# EAGLE design WindStation (EAGLE 9.3.2)
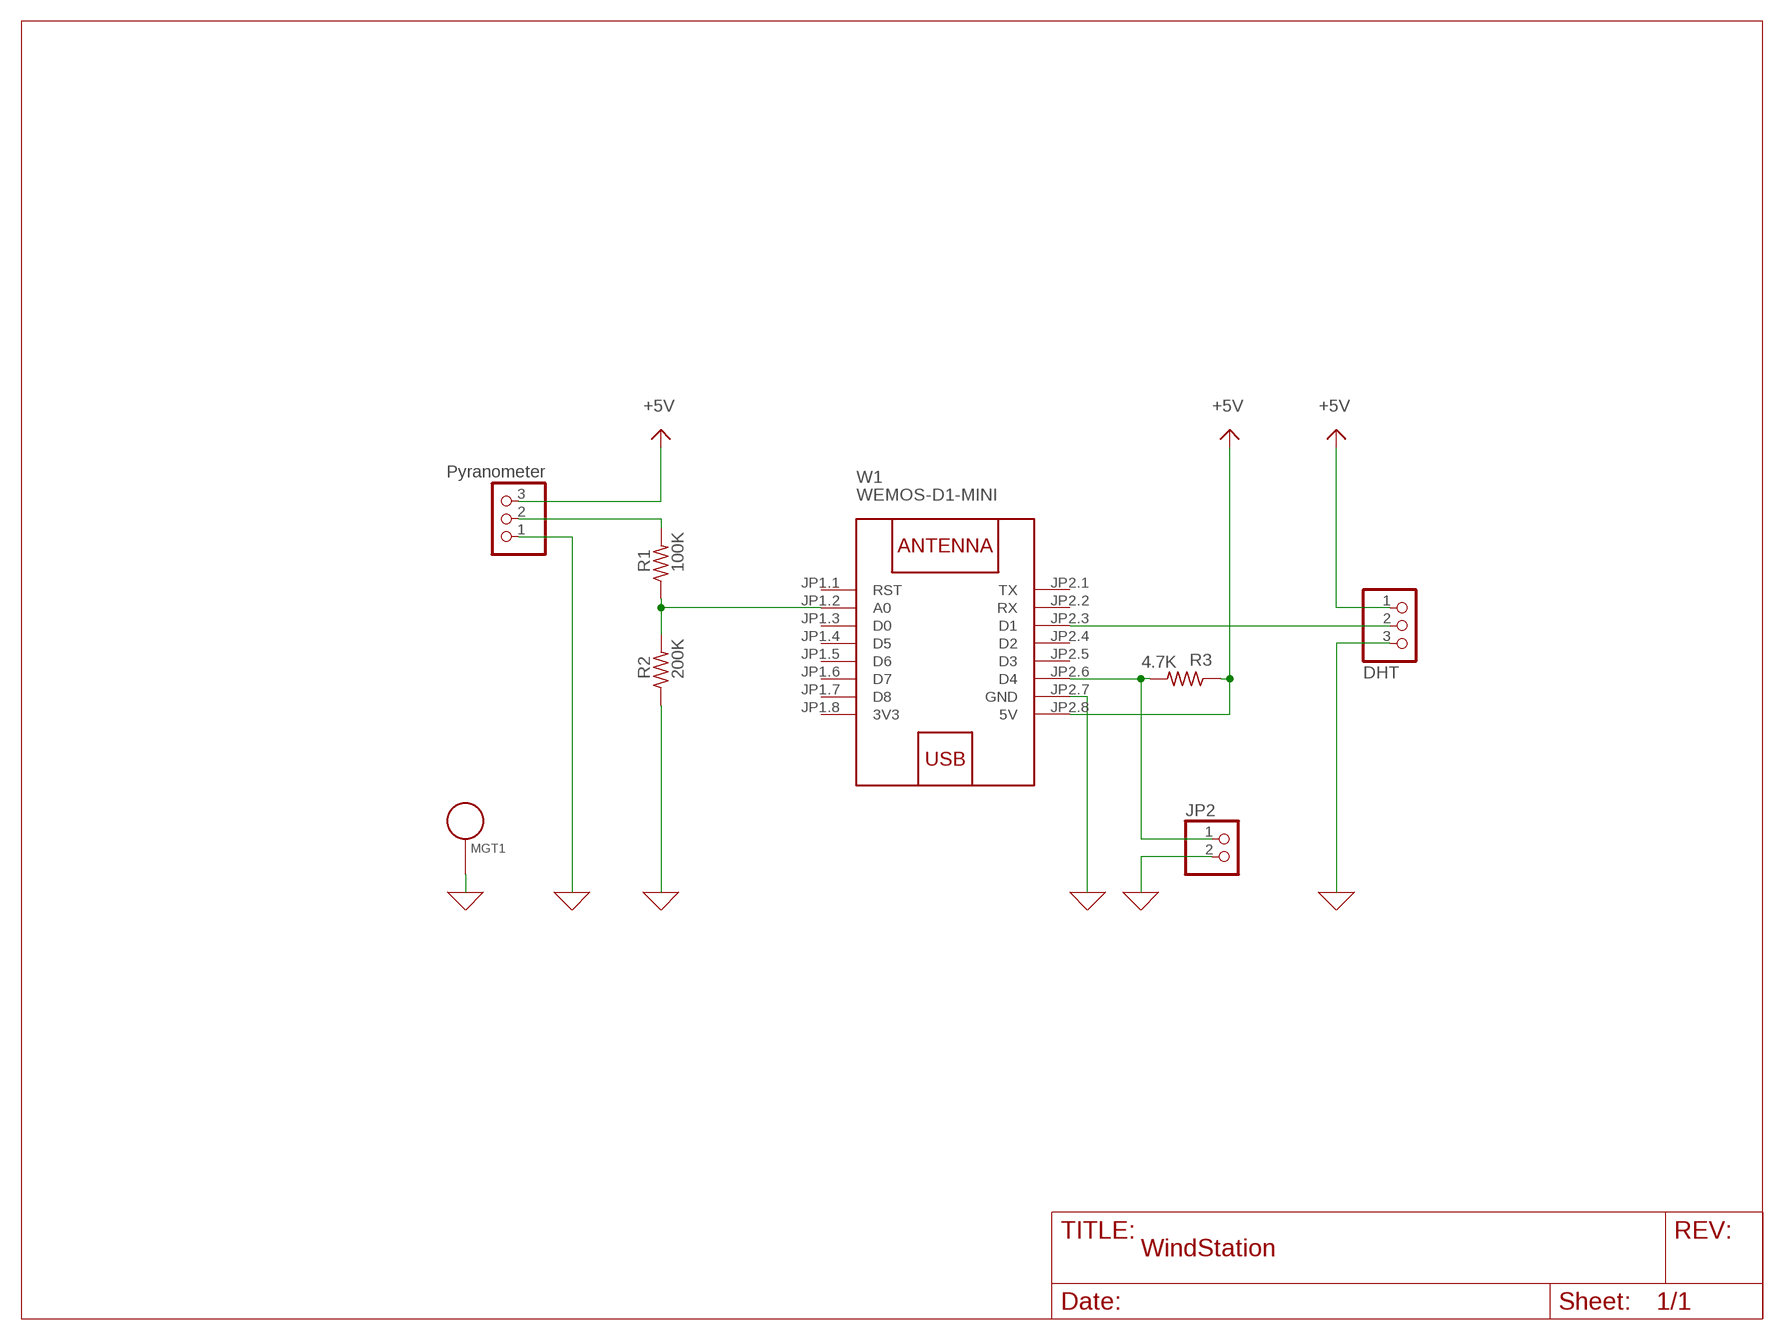
[diagram p0: schematic, sheet 1]

## Parts
JP1  Pyranometer  PINHD-1X3  [1X03]
JP2  PINHD-1X2  [1X02]
JP3  DHT  PINHD-1X3  [1X03]
MGT1  BEAGLEBONEBLACK_MOUNTING_HOLE  [BEAGLEBONEBLACK_MOUNTING_HOLE]
R1  100K  R-US_0207/10  [0207/10]
R2  200K  R-US_0207/10  [0207/10]
R3  4.7K  R-US_0207/10  [0207/10]
W1  WEMOS-D1-MINI  [WEMOS-D1-MINI]

## Nets
0: JP1.1 JP2.2 JP3.3 MGT1.P$1 R2.1 W1.JP2.7(GND) ; supply symbol labelled GND
N$1: JP1.2 R1.2
N$2: R1.1 R2.2 W1.JP1.2(A0)
N$3: JP2.1 R3.2 W1.JP2.6(D4)
N$4: JP3.2 W1.JP2.3(D1)
VCC: JP1.3 JP3.1 R3.1 W1.JP2.8(5V)
Unconnected: W1.JP1.1(RST) W1.JP1.3(D0) W1.JP1.4(D5) W1.JP1.5(D6) W1.JP1.6(D7) W1.JP1.7(D8) W1.JP2.1(TX) W1.JP2.2(RX) W1.JP2.4(D2) W1.JP2.5(D3)

## Notes on the sheet
- +5V | +5V | +5V

## Power pins joined to a net without a drawn wire
3V3: W1.JP1.8(3V3)

## Library data of the parts
JP1 JP3 = adafruit:PINHD-1X3: PIN HEADER
JP2 = pinhead:PINHD-1X2: PIN HEADER
MGT1 = BeagleBone_Black_Wireless:BEAGLEBONEBLACK_MOUNTING_HOLE: Chassis Mounting Hole w/GND connection ability
R1-R3 = adafruit:R-US_: RESISTOR, American symbol
W1 = diy-modules:WEMOS-D1-MINI: WEMOS D1 mini: Mini Wi-Fi Board based on ESP-8266 device More details can be found here: https://www.wemos.cc/product/d1-mini.html Click here to find device on ebay.com <http://www.ebay.com/sch/wemos+d1+mini+nodemcu>

## Board
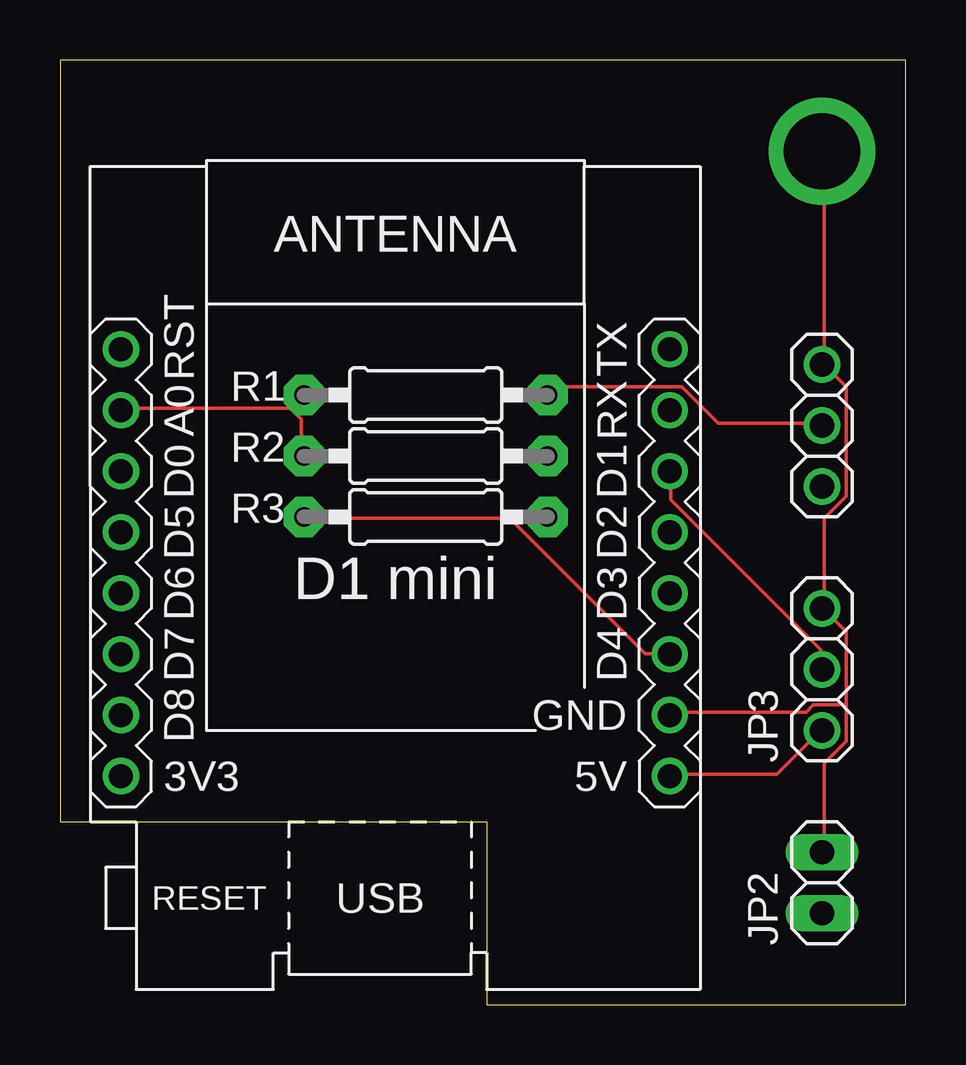
[diagram p1: board, top side]
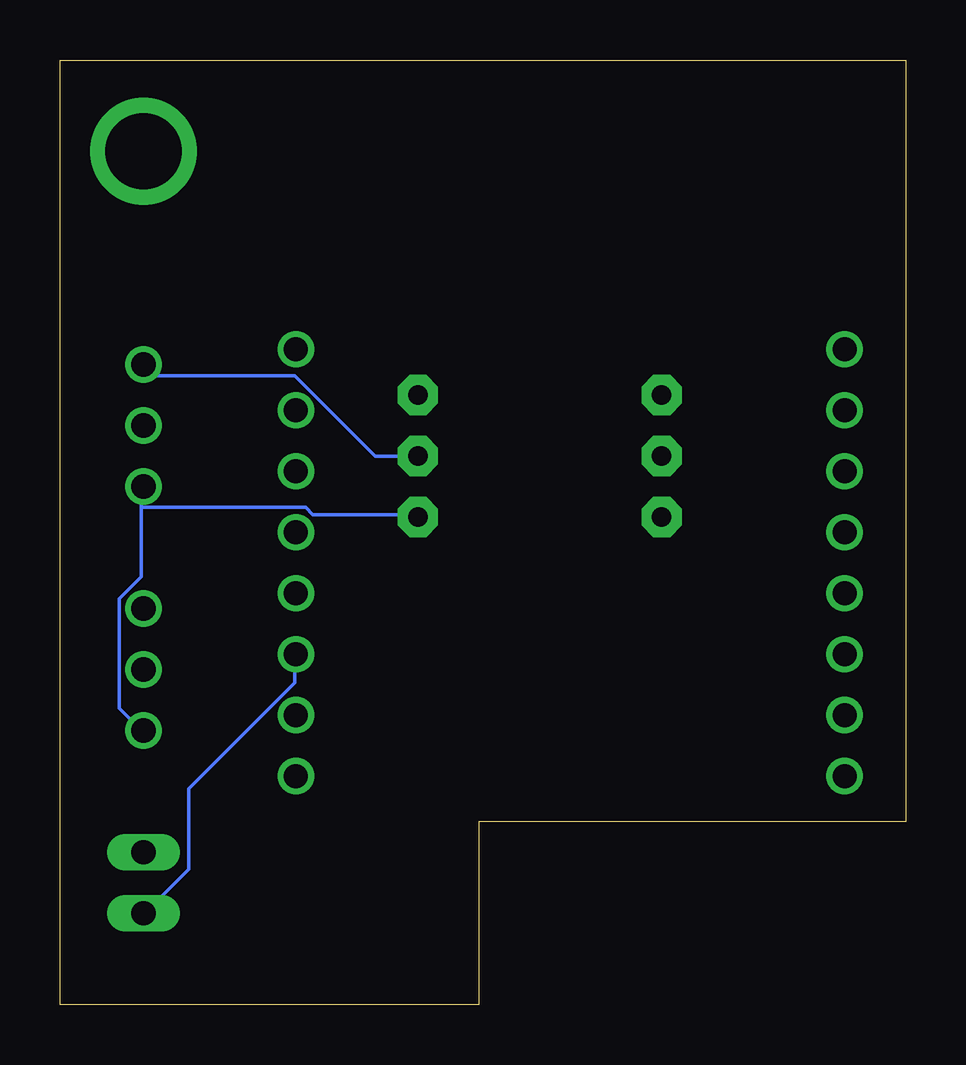
[diagram p2: board, bottom side, seen from below]

Size 35.23 x 39.36 mm. Coordinates in mm from the lower left corner, seen from the top.
Outline: 0,7.62 17.78,7.62 17.78,0 35.23,0 35.23,39.36 0,39.36 0,7.62
Copper layers (1*16): Top 0.035mm / dielectric 1.5mm / Bottom 0.035mm
Design rules "default": minimum track width 6mil, minimum drill 0.35mm, track to track 6mil, track to pad 6mil, pad to pad 6mil, via to via 6mil, smd to smd 6mil, copper to edge 40mil, drill to drill 6mil, minimum pad ring 10mil, minimum via ring 8mil, stop-mask expansion 4mil, vias tented up to drill 0mil, thermal gap 10mil

### Footprints (pad centres in the part's own frame; a part is rotated, then mirrored left to right if it is on the bottom)
1X03 = drill 1.016: 1 -2.54,0; 2 0,0; 3 2.54,0
1X02 = drill 1.016 long: 1 -1.27,0; 2 1.27,0
BEAGLEBONEBLACK_MOUNTING_HOLE = drill 3.175 pad 4.445: P$1 0,0
0207/10 = drill 0.813 pad 1.676 octagon: 1 -5.08,0; 2 5.08,0
WEMOS-D1-MINI = drill 1: JP1.1 -11.43,9.525; JP1.2 -11.43,6.985; JP1.3 -11.43,4.445; JP1.4 -11.43,1.905; JP1.5 -11.43,-0.635; JP1.6 -11.43,-3.175; JP1.7 -11.43,-5.715; JP1.8 -11.43,-8.255; JP2.1 11.43,9.525; JP2.2 11.43,6.985; JP2.3 11.43,4.445; JP2.4 11.43,1.905; JP2.5 11.43,-0.635; JP2.6 11.43,-3.175; JP2.7 11.43,-5.715; JP2.8 11.43,-8.255

### Placement (x,y rotation side)
JP1  31.75,24.13 270 top
JP2  31.75,5.08 90 top
JP3  31.75,13.97 90 top
MGT1  31.75,35.56 0 top
R1  15.24,25.4 0 top
R2  15.24,22.86 180 top
R3  15.24,20.32 180 top
W1  13.97,17.78 0 top

### Tracks (layer width: path | path; a pad name or v marks a point on that pad's centre or on a via)
0
  Top 0.152: 32.77,12.5 32.77,15.54 31.85,16.46 JP3.3 31.85,16.61 31.85,20.27 32.77,21.18 32.77,25.76 31.85,26.67 | 32.77,12.5 32.77,10.97 31.85,10.06 31.85,6.4 JP2.2 | 31.85,26.67 31.85,35.51 MGT1.P$1 | 31.85,26.67 JP1.1 | 32.77,12.5 31.39,12.5 31.09,12.19 25.45,12.19 W1.JP2.7
  Bottom 0.152: R2.1 22.1,22.86 25.45,26.21 31.24,26.21 31.7,26.67 JP1.1
N$1
  Top 0.152: JP1.2 31.7,24.23 27.43,24.23 25.91,25.76 20.73,25.76 20.42,25.45 R1.2
N$2
  Top 0.152: 9.6,24.84 2.59,24.84 W1.JP1.2 | 9.6,24.84 R1.1 10.06,25.3 | 9.6,24.84 10.06,24.38 10.06,22.86 R2.2
N$3
  Top 0.152: R3.2 10.21,20.27 18.75,20.27 24.38,14.63 25.3,14.63 W1.JP2.6
  Bottom 0.152: W1.JP2.6 25.45,14.48 25.45,13.41 29.87,8.99 29.87,5.64 31.7,3.81 JP2.1
N$4
  Top 0.152: W1.JP2.3 25.45,22.1 25.45,21.03 31.7,14.78 31.7,14.02 JP3.2
VCC
  Top 0.152: W1.JP2.8 25.45,9.6 29.87,9.6 31.7,11.43 JP3.1
  Bottom 0.152: 31.85,20.73 31.85,17.83 32.77,16.92 32.77,12.34 31.85,11.43 JP3.1 | 31.85,20.73 31.85,21.49 JP1.3 | 31.85,20.73 24.99,20.73 24.69,20.42 20.42,20.42 R3.1